# Altium project Onlab.PrjPcb
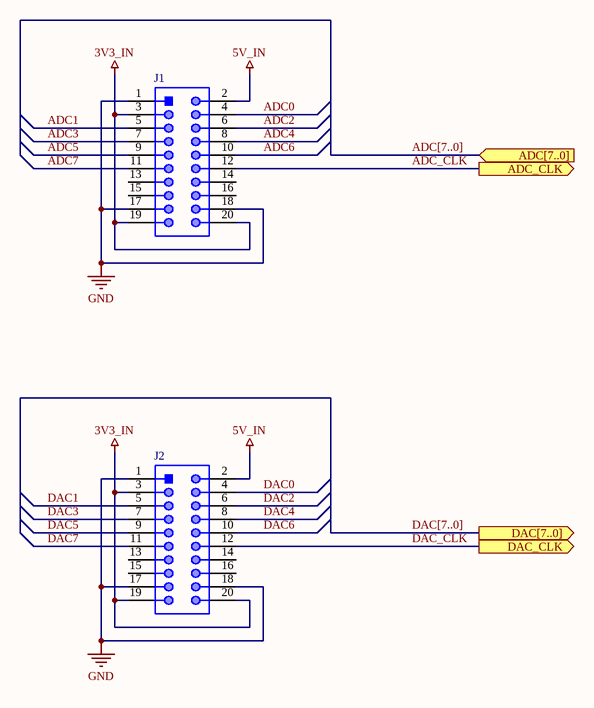
[diagram p0: Onlab.SchDoc]
4 sheets, 55 parts. Net scope: flat (ports and power ports of the same name join across sheets).
Sheets:
  Onlab.SchDoc
  PSU.SchDoc
  ADC.SchDoc
  DAC.SchDoc

## Sheet Onlab.SchDoc
size A; SheetNumber: 1; SheetTotal: 4

### Parts
J1  61302021021  [61302021021]  (value not drawn)
J2  61302021021  [61302021021]  (value not drawn)

### Ports
ADC[7..0] (in), ADC_CLK (out), DAC[7..0] (out), DAC_CLK (out)

### Nets
3V3_IN: J1.3 J1.19 J1.20 J2.3 J2.19 J2.20
5V_IN: J1.2 J2.2
GND: J1.1 J1.17 J1.18 J2.1 J2.17 J2.18
ADC0: J1.4
ADC1: J1.5
ADC2: J1.6
ADC3: J1.7
ADC4: J1.8
ADC5: J1.9
ADC6: J1.10
ADC7: J1.11
ADC_CLK: J1.12 ; port ADC_CLK
DAC0: J2.4
DAC1: J2.5
DAC2: J2.6
DAC3: J2.7
DAC4: J2.8
DAC5: J2.9
DAC6: J2.10
DAC7: J2.11
DAC_CLK: J2.12 ; port DAC_CLK

Not connected (* = marked no-connect by the designer): J1 13 14 15 16; J2 13 14 15 16

### Buses and harness runs
bus ADC[7..0] = port ADC[7..0]
bus DAC[7..0] = port DAC[7..0]

### Library data of the parts
J1 J2 = CMP-1502-01103-1: THT Angled Pin Header WR-PHD, Pitch 2.54 mm, Dual Row, 20 pins; Manufacturer: Wurth Elektronik; Working Voltage: 250VAC; Pin Number: 20; Contact Resistance: 20mOhm; Pitch: 2.54mm; Withstanding Voltage: 500VAC; Rated Current: 3A; Gender: Male; Manufacturer URL: http://www.we-online.de; Mounting Technology: THT; Packaging: Bag; Orientation: Angled; Package Reference: 61302021021; Publisher: WurthElektronik; Datasheet URL: https://katalog.we-online.de/em/datasheet/6130xx21021.pdf; Operating Temperature: -40to105degC; Part Number: 61302021021; Row Number: Dual

## Sheet PSU.SchDoc
size A; SheetNumber: 2; SheetTotal: 4
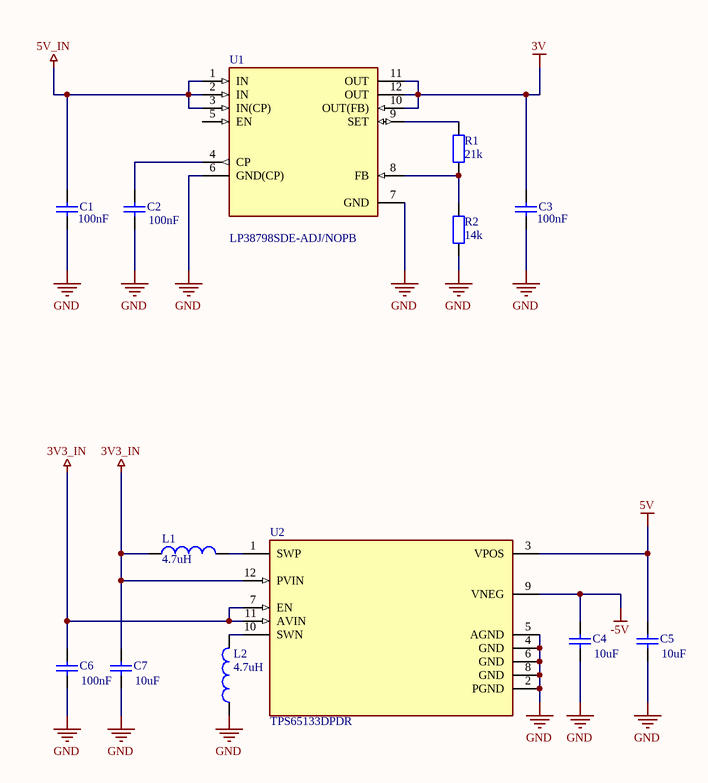
[diagram p1: PSU.SchDoc]

### Parts
C1  value 100nF  [C1206]  (hidden comment: Cap Semi)
C2  value 100nF  [C1206]  (hidden comment: Cap Semi)
C3  value 100nF  [C1206]  (hidden comment: Cap Semi)
C4  value 10uF  [C1206]  (hidden comment: Cap Semi)
C5  value 10uF  [C1206]  (hidden comment: Cap Semi)
C6  value 100nF  [C1206]  (hidden comment: Cap Semi)
C7  value 10uF  [C1206]  (hidden comment: Cap Semi)
L1  value 4.7uH  [0402-A]  (hidden comment: Inductor)
L2  value 4.7uH  [0402-A]  (hidden comment: Inductor)
R1  value 21k  [AXIAL-0.4]  (hidden comment: Res2)
R2  value 14k  [AXIAL-0.4]  (hidden comment: Res2)
U1  LP38798SDE-ADJ-NOPB  [Texas_Instruments_DNT0012B_0]  (value not drawn)
U2  TPS65133DPDR  [FP-DPD0012A-MFG]

### Nets
3V: C3.2 U1.10(OUT(FB)) U1.11(OUT) U1.12(OUT)  [project net VA]
3V3_IN: C6.2 C7.2 L1.1 U2.7(EN) U2.11(AVIN) U2.12(PVIN)
5V: C5.2 U2.3(VPOS)
5V_IN: C1.2 U1.1(IN) U1.2(IN) U1.3(IN(CP))
-5V: C4.2 U2.9(VNEG)
GND: C1.1 C2.1 C3.1 C4.1 C5.1 C6.1 C7.1 L2.1 R2.1 U1.6(GND(CP)) U1.7(GND) U2.2(PGND) U2.4(GND) U2.5(AGND) U2.6(GND) U2.8(GND)
NetC2_2: C2.2 U1.4(CP)
NetL1_2: L1.2 U2.1(SWP)
NetL2_2: L2.2 U2.10(SWN)
NetR1_1: R1.1 R2.2 U1.8(FB)
NetR1_2: R1.2 U1.9(SET)

Not connected (* = marked no-connect by the designer): U1 5(EN)

### Library data of the parts
C1-C7 = Cap Semi: Capacitor (Semiconductor SIM Model); Published: 8-Jun-2000; LatestRevisionDate: 29-May-2009; LatestRevisionNote: IPC-7351 Footprint Added.; PackageReference: C1206; Publisher: Altium Limited; PackageDescription: Chip Capacitor
L1 L2 = Inductor: Code_IEC: 1005; Published: 8-Jun-2000; LatestRevisionDate: 29-May-2009; LatestRevisionNote: IPC-7351 Footprint Added.; PackageReference: 0402-A; Publisher: Altium Limited; PackageDescription: Chip Inductor; Code_JEITA: 0402
R1 R2 = Res2: Resistor; Published: 8-Jun-2000; LatestRevisionDate: 17-Jul-2002; LatestRevisionNote: Re-released for DXP Platform.; PackageReference: AXIAL-0.4; Publisher: Altium Limited; PackageDescription: Axial Device, Thru-Hole; 2 Leads; 0.4 in Pin Spacing
U1 = LP38798SDE-ADJ/NOPB: IC REG LIN POS ADJ 800MA 12WSON; Manufacturer: Texas Instruments; Accuracy Percentage: 1%; Capacitance: SKIP; Dropout Voltage: 200mV; Library Path1: parts/IC_Texas_Instruments_LP38798SDE-ADJ-NOPB_eec.SchLib; Max Junction Temp: +125°C; Max Supply Voltage: 20V; Min Supply Voltage: 3V; Number Of Outputs: 1; Output Voltage: 1.2-19.8V; Value: SKIP; Verification Version: 0.0.0.1; Part Number: LP38798SDE-ADJ/NOPB; Datasheet Path: datasheets/IC_Texas_Instruments_LP38798SDE-ADJ-NOPB_eec.pdf; ComponentLink1Description: Upverter; ComponentLink1URL: https://upverter.com/upn/revision/7cdef7abd6330448/; ComponentLink2Description: Datasheet; ComponentLink2URL: http://www.ti.com/lit/ds/symlink/lp38798.pdf; Datasheet Path1: datasheets/IC_Texas_Instruments_LP38798SDE-ADJ-NOPB_eec.pdf; Digikey Description: IC REG LIN POS ADJ 800MA 12WSON; Digikey Part Number: 296-36225-1-ND; Height: 0.8mm; Inductance: SKIP; Lead Free: yes; Library Ref1: LP38798SDE-ADJ-NOPB; Mouser Description: LDO Voltage Regulators 800mA Ultra-Lo Noise Hi PSRR LDO; Mouser Part Number: 595-LP38798SDEADJNPB; Output Current: 800mA; Package: DNT0012B; Price: 2.77405399243; Resistance: SKIP; RoHS: TRUE; Supplier 1: Digi-Key; Supplier 2: Mouser; Supplier Part Number 1: 296-36225-1-ND; Supplier Part Number 2: 595-LP38798SDEADJNPB; Temperature: -40°C to +125°C; Temperature Range High: +125°C; Temperature Range Low: -40°C; Voltage: SKIP; helpURL: https://upverter.com/upn/revision/7cdef7abd6330448/
U2 = CMP-04918-000430-1: IC REG AMOLED DISPL 2OUT 12WSON; Number of Channels: 2; Max Supply Voltage: 5V; Min Supply Voltage: 2.9V; Output Voltage: -5V; Mount: Surface Mount; Case/Package: QFN; Packaging: Tape and Reel; Lead Free: Lead Free; Radiation Hardening: No; Min Operating Temperature: -40°C; Number of Outputs: 2; Max Operating Temperature: 85°C; Number of Pins: 12; RoHS Compliant: Yes; Package Quantity: 3000

## Sheet ADC.SchDoc
size A; SheetNumber: 3; SheetTotal: 4
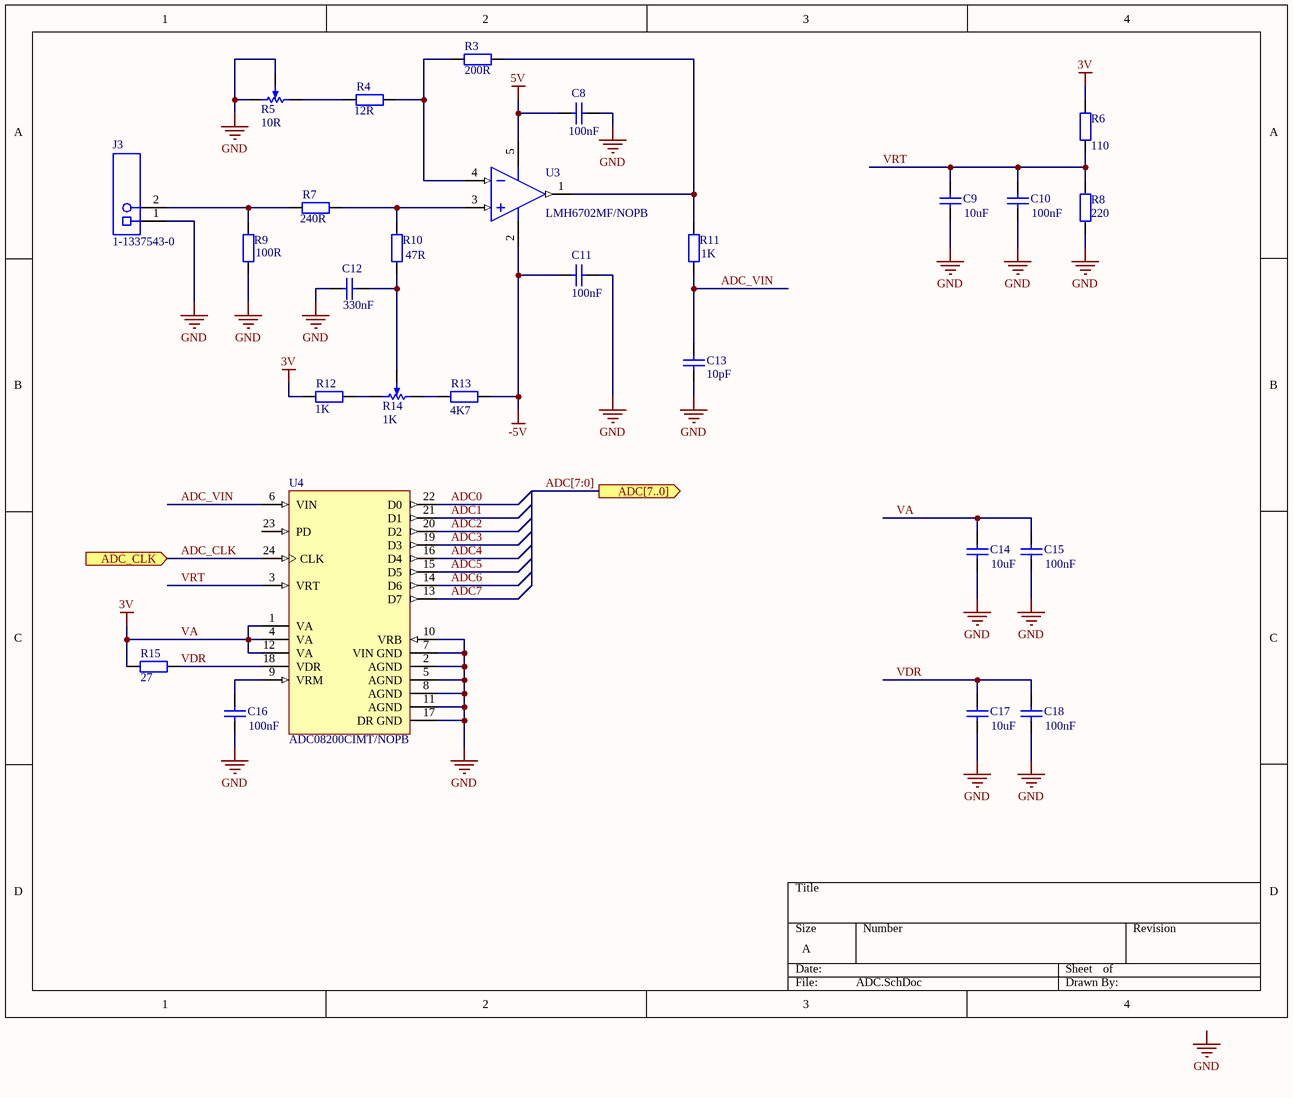
[diagram p2: ADC.SchDoc]

### Parts
C8  value 100nF  [RAD-0.3]  (hidden comment: Cap)
C9  value 10uF  [RAD-0.3]  (hidden comment: Cap)
C10  value 100nF  [RAD-0.3]  (hidden comment: Cap)
C11  value 100nF  [RAD-0.3]  (hidden comment: Cap)
C12  value 330nF  [RAD-0.3]  (hidden comment: Cap)
C13  value 10pF  [RAD-0.3]  (hidden comment: Cap)
C14  value 10uF  [RAD-0.3]  (hidden comment: Cap)
C15  value 100nF  [RAD-0.3]  (hidden comment: Cap)
C16  value 100nF  [RAD-0.3]  (hidden comment: Cap)
C17  value 10uF  [RAD-0.3]  (hidden comment: Cap)
C18  value 100nF  [RAD-0.3]  (hidden comment: Cap)
J3  1-1337543-0  [TECO-1-1337543-0_V]
R3  value 200R  [AXIAL-0.4]  (hidden comment: Res2)
R4  value 12R  [AXIAL-0.4]  (hidden comment: Res2)
R5  10R  [POT4MM-2]
R6  value 110  [AXIAL-0.4]  (hidden comment: Res2)
R7  value 240R  [AXIAL-0.4]  (hidden comment: Res2)
R8  value 220  [AXIAL-0.4]  (hidden comment: Res2)
R9  value 100R  [AXIAL-0.4]  (hidden comment: Res2)
R10  value 47R  [AXIAL-0.4]  (hidden comment: Res2)
R11  value 1K  [AXIAL-0.4]  (hidden comment: Res2)
R12  value 1K  [AXIAL-0.4]  (hidden comment: Res2)
R13  value 4K7  [AXIAL-0.4]  (hidden comment: Res2)
R14  1K  [POT4MM-2]
R15  value 27  [AXIAL-0.4]  (hidden comment: Res2)
U3  LMH6702MF/NOPB  [DBV0005A_N]
U4  ADC08200CIMT/NOPB  [PW0024A_M]

### Ports
ADC[7..0] (out), ADC_CLK (in)

### Nets
5V: C8.1 U3.5(V+)
-5V: C11.1 R13.1 U3.2(V-)
GND: C8.2 C9.1 C10.1 C11.2 C12.1 C13.1 C14.1 C15.1 C16.1 C17.1 C18.1 J3.1 R5.CW(+) R5.W R8.1 R9.1 U4.2(AGND) U4.5(AGND) U4.7(VIN_GND) U4.8(AGND) U4.10(VRB) U4.11(AGND) U4.17(DR_GND)
VA: C14.2 C15.2 R6.2 R12.2 R15.2 U4.1(VA) U4.4(VA) U4.12(VA)  [also labelled 3V]
ADC0: U4.22(D0)
ADC1: U4.21(D1)
ADC2: U4.20(D2)
ADC3: U4.19(D3)
ADC4: U4.16(D4)
ADC5: U4.15(D5)
ADC6: U4.14(D6)
ADC7: U4.13(D7)
ADC_CLK: U4.24(CLK) ; port ADC_CLK
ADC_VIN: C13.2 R11.1 U4.6(VIN)
VDR: C17.2 C18.2 R15.1 U4.18(VDR)
VRT: C9.2 C10.2 R6.1 R8.2 U4.3(VRT)
NetC12_2: C12.2 R10.1 R14.W
NetC16_2: C16.2 U4.9(VRM)
NetJ3_2: J3.2 R7.1 R9.2
NetR3_1: R3.1 R4.2 U3.4(IN-)
NetR3_2: R3.2 R11.2 U3.1(OUT)
NetR4_1: R4.1 R5.CCW(-)
NetR7_2: R7.2 R10.2 U3.3(IN+)
NetR12_1: R12.1 R14.CW(+)
NetR13_2: R13.2 R14.CCW(-)

Not connected (* = marked no-connect by the designer): U4 23(PD)

### Buses and harness runs
bus ADC[7:0] = port ADC[7..0]

### Notes on the sheet
- Labels drawn without touching a wire or pin: GND

### Library data of the parts
C8-C18 = Cap: Capacitor; Published: 8-Jun-2000; LatestRevisionDate: 17-Jul-2002; LatestRevisionNote: Re-released for DXP Platform.; PackageReference: RAD-0.3; Publisher: Altium Limited; PackageDescription: Radial Cap, Thru-Hole; 2 Leads; 0.3 in Pin Spacing
J3 = CMP-2000-05853-1: Female Connector, Pitch 2.54 mm, 1 x 2 Position, Height 15.8 mm, Tail Length 3.8 mm, / -55 to 85 degC, RoHS, Bulk; Manufacturer: TE Connectivity; Connector Body Style: RightAngleJack; Frequency Max: 4GHz; Coaxial Termination: Solder; Connector Mounting: PCBMount; SVHC: ToBeAdvised; Connector Type: BNCCoaxial; Impedance: 50ohm; Coaxial Cable Types: -; Manufacturer URL: http://www.te.com/; Package Reference: 1-1337543-0; Product Range: -; Datasheet URL: http://www.te.com/commerce/DocumentDelivery/DDEController?Action=showdoc&DocId=Customer+Drawing%7F1337543%7FG%7Fpdf%7FEnglish%7FENG_CD_1337543_G.pdf%7F1-1337543-0; Contact Plating: GoldPlatedContacts; Mounting Technology: ThroughHole; Package Description: Female Connector, Pitch 2.54 mm, 1 x 2 Position, Height 15.8 mm, Tail Length 3.8 mm; Contact Material: Brass; Datasheet Version: Rev. G, 12/2012
R3 R4 R6-R13 R15 = Res2: Resistor; Published: 8-Jun-2000; LatestRevisionDate: 17-Jul-2002; LatestRevisionNote: Re-released for DXP Platform.; PackageReference: AXIAL-0.4; Publisher: Altium Limited; PackageDescription: Axial Device, Thru-Hole; 2 Leads; 0.4 in Pin Spacing
R5 R14 = RPot SM: Square Trimming Potentiometer; Published: 17-Dec-2003; DatasheetVersion: Oct-2003; PackageReference: POT4MM-2; Publisher: Altium Limited; PackageDescription: Square Trimming Potentiometer; ComponentLink1Description: Manufacturer Link; ComponentLink1URL: http://bourns.com/2/search.html
U3 = CMP-0055-01272-3: 1.7 GHz, Ultra Low Distortion, Wideband Op Amp, 5-pin SOT-23, Pb-Free; Manufacturer: Texas Instruments; CompType: Amplifiers; PackageTopMarking: A83A*XTT; PowerWise: Y; Package Reference: DBV0005A; RoHS: Y; ComponentLink1Description: Datasheet URL; PackageDescription: Molded SOT-23, .115 x .063 x .040 in Body, 5 Lead, .0375 in Pitch; PinCount: 5; ComponentLink1URL: http://www.ti.com/general/docs/lit/getliterature.tsp?genericPartNumber=LMH6702&fileType=pdf
U4 = CMP-0054-00424-3: 8-Bit, 20 MSPS to 200 MSPS, Low Power A/D Converter with Internal Sample-and-Hold, 24-pin TSSOP, Pb-Free; Manufacturer: Texas Instruments; PowerWise: N; CompType: ADC IC; PackageTopMarking: NSUZXYTTE#*ADC08200*CIMT; Code_JEDEC: MO-153-AD; ComponentLink1URL: http://www.ti.com/general/docs/lit/getliterature.tsp?genericPartNumber=ADC08200&fileType=pdf; PackageDescription: Molded TSSOP, Jedec, 7.8 x 4.4 x 0.9mm Body, 24 Lead, 0.65mm Pitch; RoHS: Y; PackageReference: PW0024A; PinCount: 24; ComponentLink1Description: Datasheet URL

## Sheet DAC.SchDoc
size A; SheetNumber: 4; SheetTotal: 4
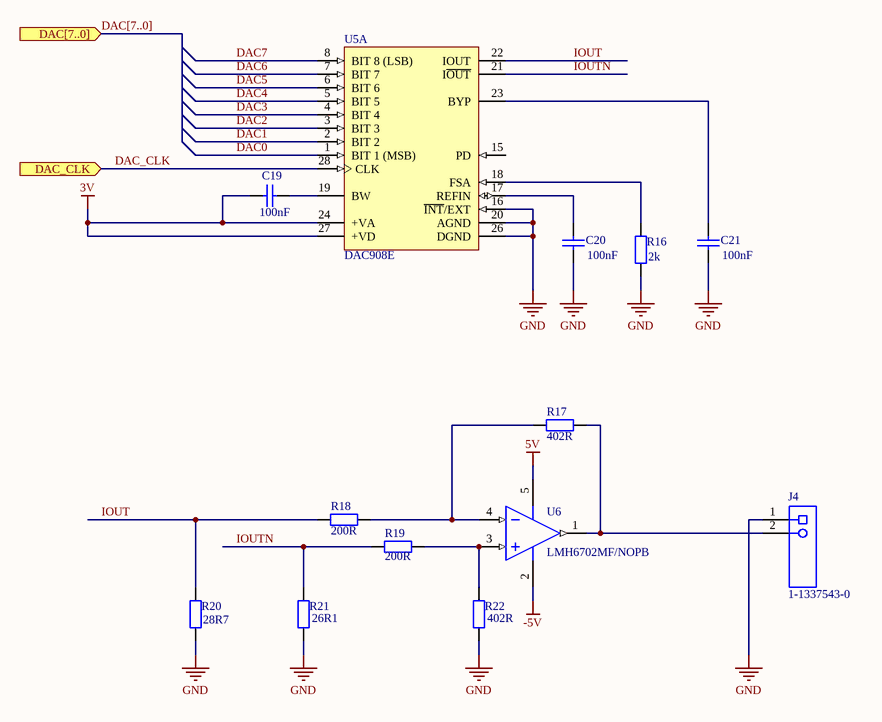
[diagram p3: DAC.SchDoc]

### Parts
C19  value 100nF  [RAD-0.3]  (hidden comment: Cap)
C20  value 100nF  [RAD-0.3]  (hidden comment: Cap)
C21  value 100nF  [RAD-0.3]  (hidden comment: Cap)
J4  1-1337543-0  [TECO-1-1337543-0_V]
R16  value 2k  [AXIAL-0.4]  (hidden comment: Res2)
R17  value 402R  [AXIAL-0.4]  (hidden comment: Res2)
R18  value 200R  [AXIAL-0.4]  (hidden comment: Res2)
R19  value 200R  [AXIAL-0.4]  (hidden comment: Res2)
R20  value 28R7  [AXIAL-0.4]  (hidden comment: Res2)
R21  value 26R1  [AXIAL-0.4]  (hidden comment: Res2)
R22  value 402R  [AXIAL-0.4]  (hidden comment: Res2)
U5  DAC908E  [TI-PW28_N]  (part A of 2)
U6  LMH6702MF/NOPB  [DBV0005A_N]

### Ports
DAC[7..0] (in), DAC_CLK (in)

### Nets
3V: C19.1 U5.24(+VA) U5.27(+VD)  [project net VA]
5V: U6.5(V+)
-5V: U6.2(V-)
GND: C20.1 C21.1 J4.1 R16.1 R20.1 R21.1 R22.1 U5.16(~{INT}/EXT) U5.20(AGND) U5.26(DGND)
DAC0: U5.1(BIT_1_(MSB))
DAC1: U5.2(BIT_2)
DAC2: U5.3(BIT_3)
DAC3: U5.4(BIT_4)
DAC4: U5.5(BIT_5)
DAC5: U5.6(BIT_6)
DAC6: U5.7(BIT_7)
DAC7: U5.8(BIT_8_(LSB))
DAC_CLK: U5.28(CLK) ; port DAC_CLK
IOUT: R18.1 R20.2 U5.22(IOUT)
IOUTN: R19.1 R21.2 U5.21(I~{OUT})
NetC19_2: C19.2 U5.19(BW)
NetC20_2: C20.2 U5.17(REFIN)
NetC21_2: C21.2 U5.23(BYP)
NetJ4_2: J4.2 R17.1 U6.1(OUT)
NetR16_2: R16.2 U5.18(FSA)
NetR17_2: R17.2 R18.2 U6.4(IN-)
NetR19_2: R19.2 R22.2 U6.3(IN+)

Not connected (* = marked no-connect by the designer): U5 15(PD)

### Buses and harness runs
bus DAC[7..0] = port DAC[7..0]

### Library data of the parts
C19-C21 = Cap: Capacitor; Published: 8-Jun-2000; LatestRevisionDate: 17-Jul-2002; LatestRevisionNote: Re-released for DXP Platform.; PackageReference: RAD-0.3; Publisher: Altium Limited; PackageDescription: Radial Cap, Thru-Hole; 2 Leads; 0.3 in Pin Spacing
J4 = CMP-2000-05853-1: as J3 on sheet ADC; Coaxial Cable Types: -; Manufacturer URL: http://www.te.com/; Package Reference: 1-1337543-0; Product Range: -; Datasheet URL: http://www.te.com/commerce/DocumentDelivery/DDEController?Action=showdoc&DocId=Customer+Drawing%7F1337543%7FG%7Fpdf%7FEnglish%7FENG_CD_1337543_G.pdf%7F1-1337543-0; Contact Plating: GoldPlatedContacts; Mounting Technology: ThroughHole; Package Description: Female Connector, Pitch 2.54 mm, 1 x 2 Position, Height 15.8 mm, Tail Length 3.8 mm; Contact Material: Brass; Datasheet Version: Rev. G, 12/2012
R16-R22 = Res2: Resistor; Published: 8-Jun-2000; LatestRevisionDate: 17-Jul-2002; LatestRevisionNote: Re-released for DXP Platform.; PackageReference: AXIAL-0.4; Publisher: Altium Limited; PackageDescription: Axial Device, Thru-Hole; 2 Leads; 0.4 in Pin Spacing
U5 = CMP-0004-01392-1: 8-Bit, 165 MSPS SpeedPlus(TM) DAC Scalable Current Outputs between 2 to 20 mA, -40 to 85 degC, 28-pin SOP (PW28), Green (RoHS & no Sb/Br); Manufacturer: Texas Instruments; Resolution(Bits): 8; SFDR(dB): 67; SubFamily: High Speed DAC (>10MSPS); DAC Channels: 1; Power Consumption(Typ)(mW): 170; Settling Time(us): 0.03; INL(Max)(+/-LSB): 0.5; Interface: Parallel CMOS; Mounting Technology: Surface Mount; ComponentLink2Description: Datasheet; ComponentLink3Description: Package Specification; ComponentLink1URL: http://www.ti.com/; Eco-Plan: Green (RoHS & no Sb/Br); PartNumber: DAC908E; DatasheetVersion: SBAS109B; PackageDescription: 28-Pin Plastic Small Outline, Body 9.7 x 4.4 mm, Pitch 0.65 mm; Code_JEDEC: MO-153; ComponentLink3URL: http://www.ti.com/litv/pdf/mpds364; PackageVersion: 4040064-7/G, 02/2011; ComponentLink2URL: http://www.ti.com/general/docs/lit/getliterature.tsp?genericPartNumber=DAC908&fileType=pdf; ComponentLink1Description: Manufacturer URL; PackageReference: PW28; DNL(Max)(+/-LSB): 0.5
U6 = CMP-0055-01272-3: as U3 on sheet ADC; Package Reference: DBV0005A; RoHS: Y; ComponentLink1Description: Datasheet URL; PackageDescription: Molded SOT-23, .115 x .063 x .040 in Body, 5 Lead, .0375 in Pitch; PinCount: 5; ComponentLink1URL: http://www.ti.com/general/docs/lit/getliterature.tsp?genericPartNumber=LMH6702&fileType=pdf

## Nets that join several sheets
3V3_IN: Onlab (6 pins), PSU (6 pins)
5V: PSU (C5.2 U2.3), ADC (C8.1 U3.5), DAC (U6.5)
5V_IN: Onlab (J1.2 J2.2), PSU (C1.2 U1.1 U1.2 U1.3)
-5V: PSU (C4.2 U2.9), ADC (C11.1 R13.1 U3.2), DAC (U6.2)
GND: Onlab (6 pins), PSU (16 pins), ADC (23 pins), DAC (10 pins)
VA: PSU (C3.2 U1.10 U1.11 U1.12), ADC (8 pins), DAC (C19.1 U5.24 U5.27)
ADC_CLK: Onlab (J1.12), ADC (U4.24)
DAC0: Onlab (J2.4), DAC (U5.1)
DAC1: Onlab (J2.5), DAC (U5.2)
DAC2: Onlab (J2.6), DAC (U5.3)
DAC3: Onlab (J2.7), DAC (U5.4)
DAC4: Onlab (J2.8), DAC (U5.5)
DAC5: Onlab (J2.9), DAC (U5.6)
DAC6: Onlab (J2.10), DAC (U5.7)
DAC7: Onlab (J2.11), DAC (U5.8)
DAC_CLK: Onlab (J2.12), DAC (U5.28)